# EAGLE design transition_pcb (EAGLE 9.6.2)
REV: p1; TITLE: Elemental Transition
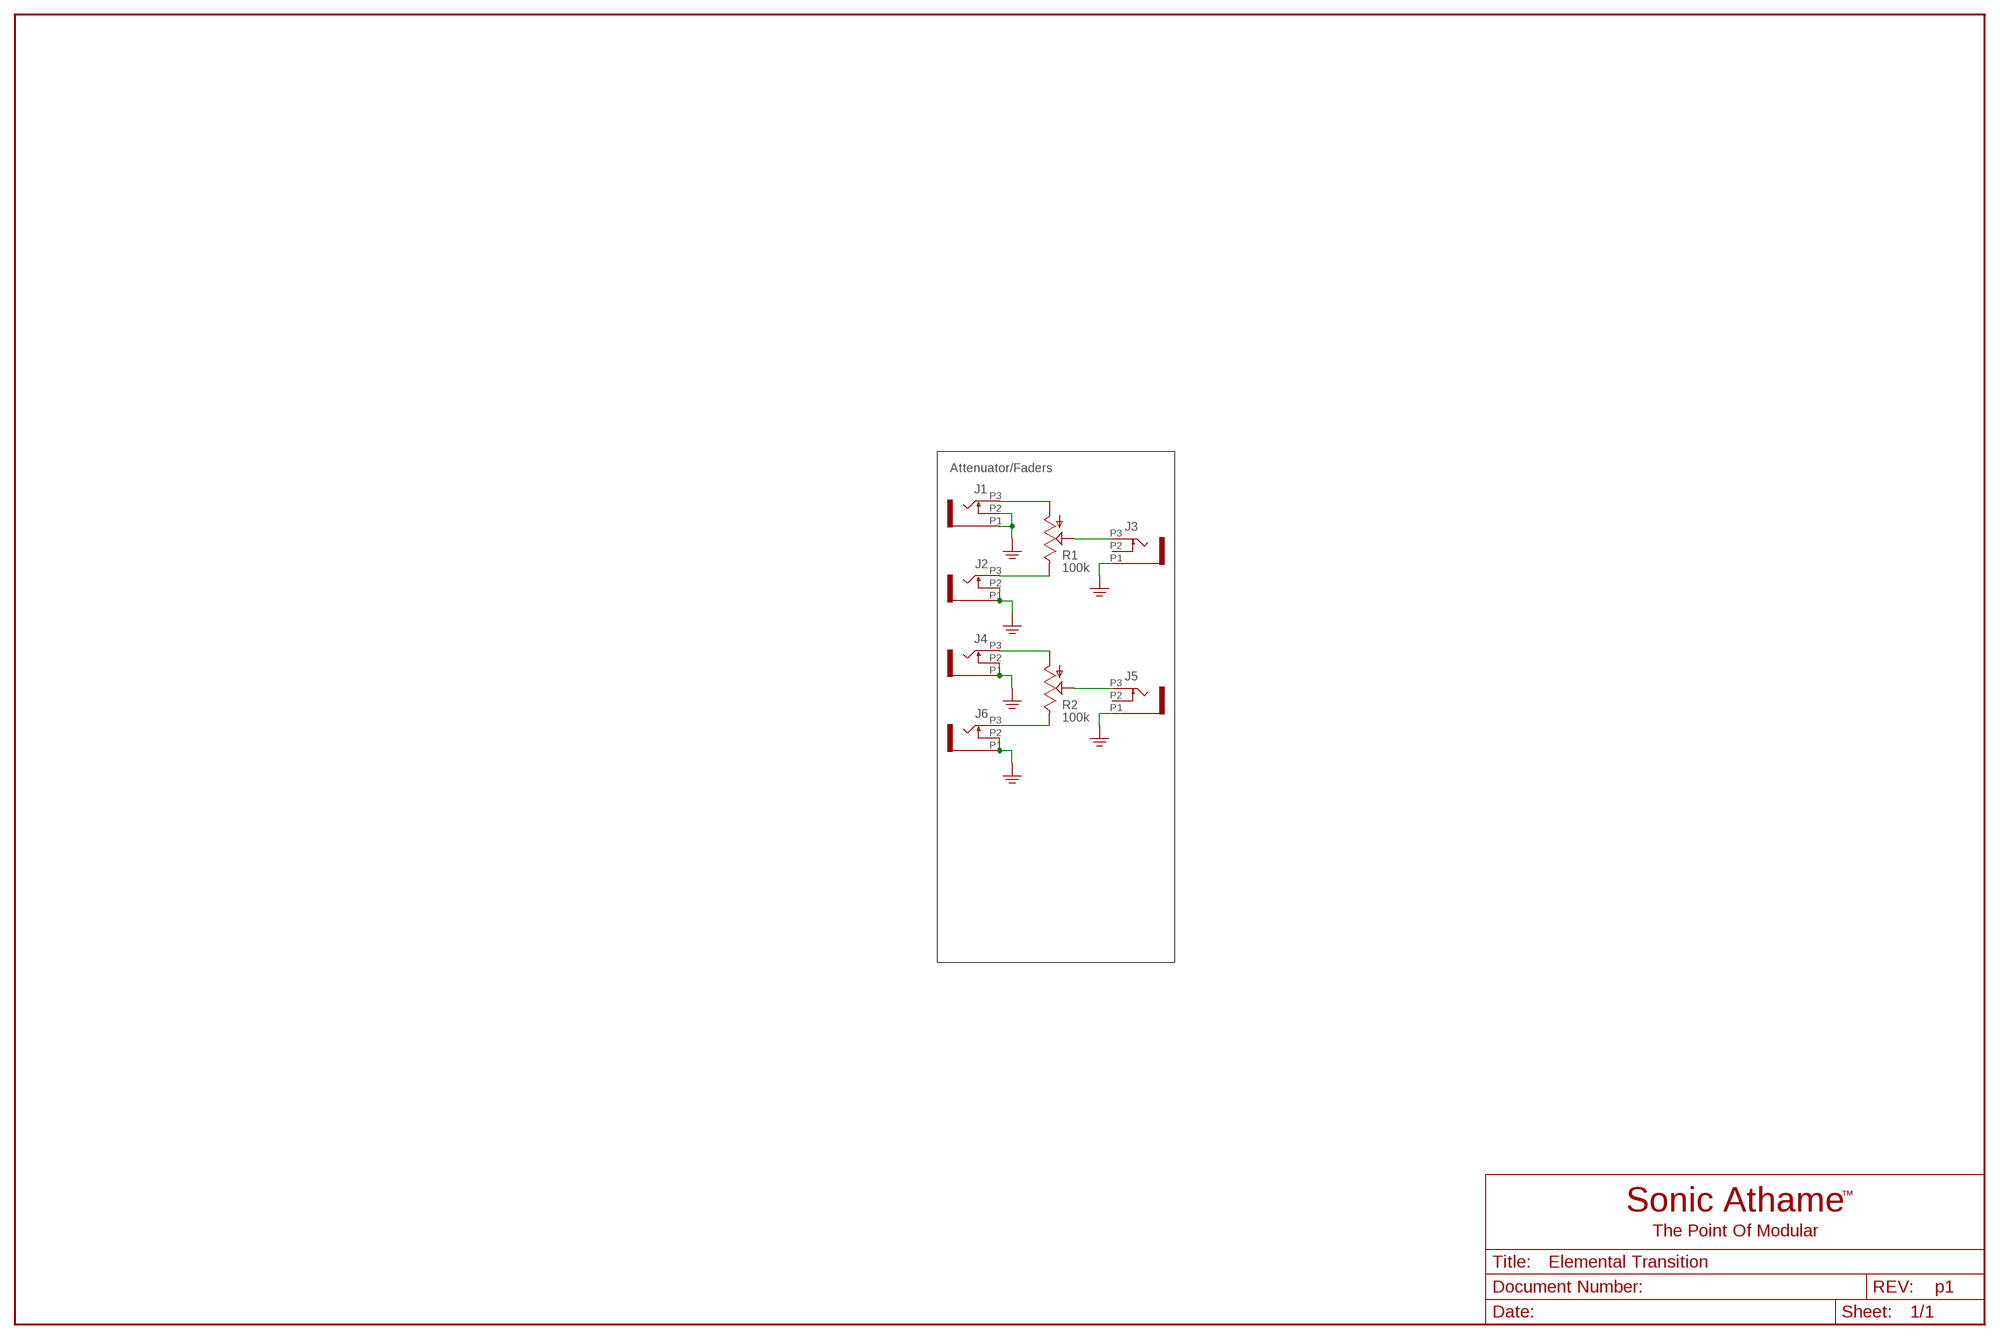
[diagram p0: schematic, sheet 1]

## Parts
J1  WQP-PJ398SM6  [WQP_PJ_301M6]
J2  WQP-PJ398SM6  [WQP_PJ_301M6]
J3  WQP-PJ398SM6  [WQP_PJ_301M6]
J4  WQP-PJ398SM6  [WQP_PJ_301M6]
J5  WQP-PJ398SM6  [WQP_PJ_301M6]
J6  WQP-PJ398SM6  [WQP_PJ_301M6]
R1  100k  ALPHA_POT_VERTICALVERTICAL  [ALPHA_POT_VERTICAL]
R2  100k  ALPHA_POT_VERTICALVERTICAL  [ALPHA_POT_VERTICAL]

## Nets
GND: J1.P1 J1.P2 J2.P1 J2.P2 J3.P1 J4.P1 J4.P2 J5.P1 J6.P1 J6.P2
N$1: J2.P3 R1.P$1(E)
N$2: J3.P3 R1.P$2(S)
N$4: J1.P3 R1.P$3(A)
N$6: J4.P3 R2.P$3(A)
N$7: J6.P3 R2.P$1(E)
N$8: J5.P3 R2.P$2(S)
Unconnected: J3.P2 J5.P2

## Notes on the sheet
- Attenuator/Faders

## Library data of the parts
J1-J6 = SonicAthame:WQP-PJ398SM
R1 R2 = SonicAthame:ALPHA_POT_VERTICAL

## Board
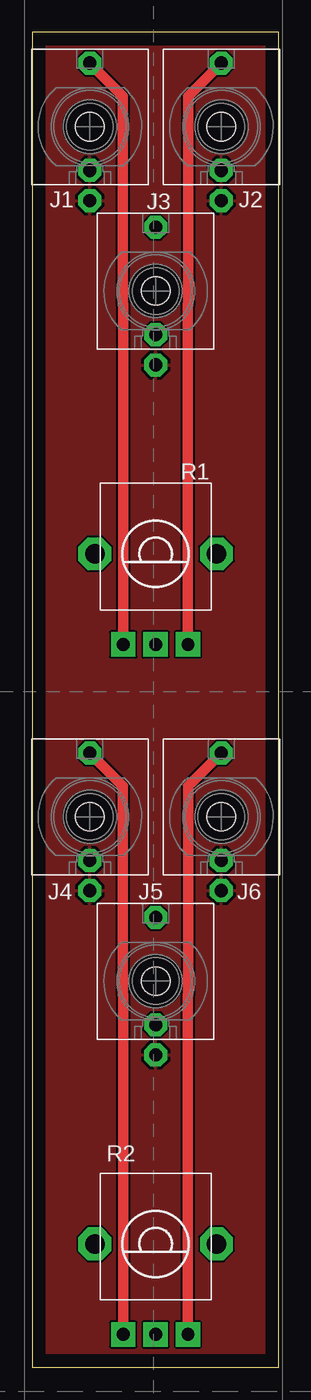
[diagram p1: board, top side]
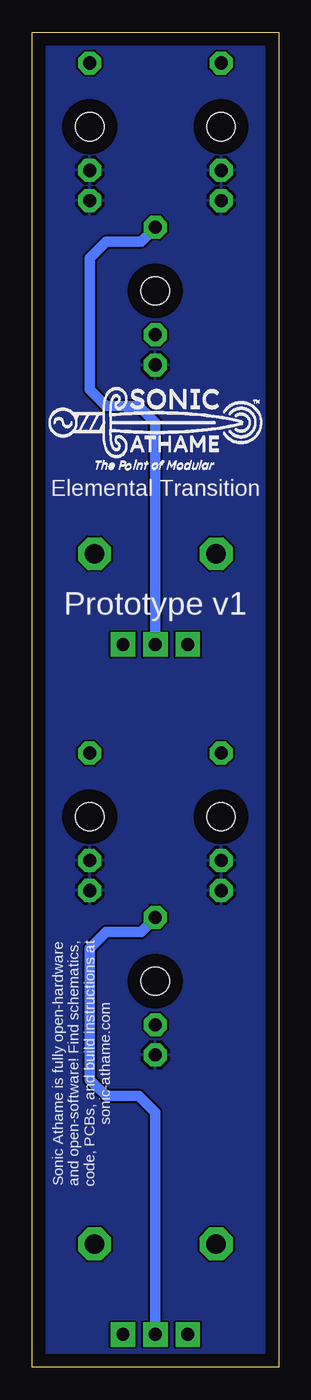
[diagram p2: board, bottom side, seen from below]

Size 19.03 x 103.17 mm. Coordinates in mm from the lower left corner, seen from the top.
Outline: 0,0 19.03,0 19.03,103.17 0,103.17 0,0
Copper layers (1*16): Top 0.035mm / dielectric 1.5mm / Bottom 0.035mm
Design rules "default": minimum track width 6mil, minimum drill 0.35mm, track to track 6mil, track to pad 6mil, pad to pad 6mil, via to via 6mil, smd to smd 6mil, copper to edge 40mil, drill to drill 6mil, minimum pad ring 10mil, minimum via ring 8mil, stop-mask expansion 4mil, vias tented up to drill 0mil, thermal gap 10mil

### Footprints (pad centres in the part's own frame; a part is rotated, then mirrored left to right if it is on the bottom)
WQP_PJ_301M6 = drill 1.016 pad 1.778 octagon: P1 0,-5.715; P2 0,-3.38; P3 0,4.92 | hole 2.2: 0,0
ALPHA_POT_VERTICAL = drill 1 pad 1.88 square: P$1 -2.5,7; P$2 0,7; P$3 2.5,7 | drill 1.5 pad 2.54 octagon: P$4 -4.7,0; P$5 4.7,0

### Placement (x,y rotation side)
J1  4.45,95.89 0 top
J2  14.61,95.89 0 top
J3  9.53,83.19 0 top
J4  4.45,42.55 0 top
J5  9.53,29.84 0 top
J6  14.61,42.55 0 top
R1  9.53,62.87 180 top
R2  9.53,9.53 180 top
U$1  [PANEL_REF_4U]  -0.64,-12.06 0 top  (outside the outline)
U$2  [LOGO-65MIL-BSILK]  9.53,73.03 0 top

### Tracks (layer width: path | path; a pad name or v marks a point on that pad's centre or on a via)
GND
  pour Bottom: -0.64,0 19.68,0 19.68,104.78 -0.64,104.78
  pour Top: -0.64,0 19.68,0 19.68,104.78 -0.64,104.78
N$1
  Top 0.813: R1.P$1 12.03,82.12 12.05,82.14 12.05,98.25 J2.P3
N$2
  Bottom 0.813: R1.P$2 9.53,73.03 10.79,74.3 13.34,74.3 14.61,75.56 14.61,85.73 13.34,87 10.63,87 J3.P3
N$4
  Top 0.813: R1.P$3 7.03,82.12 7,82.14 7,98.25 J1.P3
N$6
  Top 0.813: R2.P$3 7.03,28.78 7,28.8 7,44.91 J4.P3
N$7
  Top 0.813: R2.P$1 12.03,28.78 12.05,28.8 12.05,44.91 J6.P3
N$8
  Bottom 0.813: R2.P$2 9.53,19.69 10.79,20.96 13.34,20.96 14.61,22.23 14.61,32.39 13.34,33.66 10.63,33.66 J5.P3

### Text on the board
bNames: Elemental Transition | Prototype v1 | Sonic Athame is fully open-hardware / and open-software! Find schematics, / code, PCBs, and build instructions at / sonic-athame.com